# EAGLE design OSSIBeacon (EAGLE 6.1)

## Sheet 1 of 3
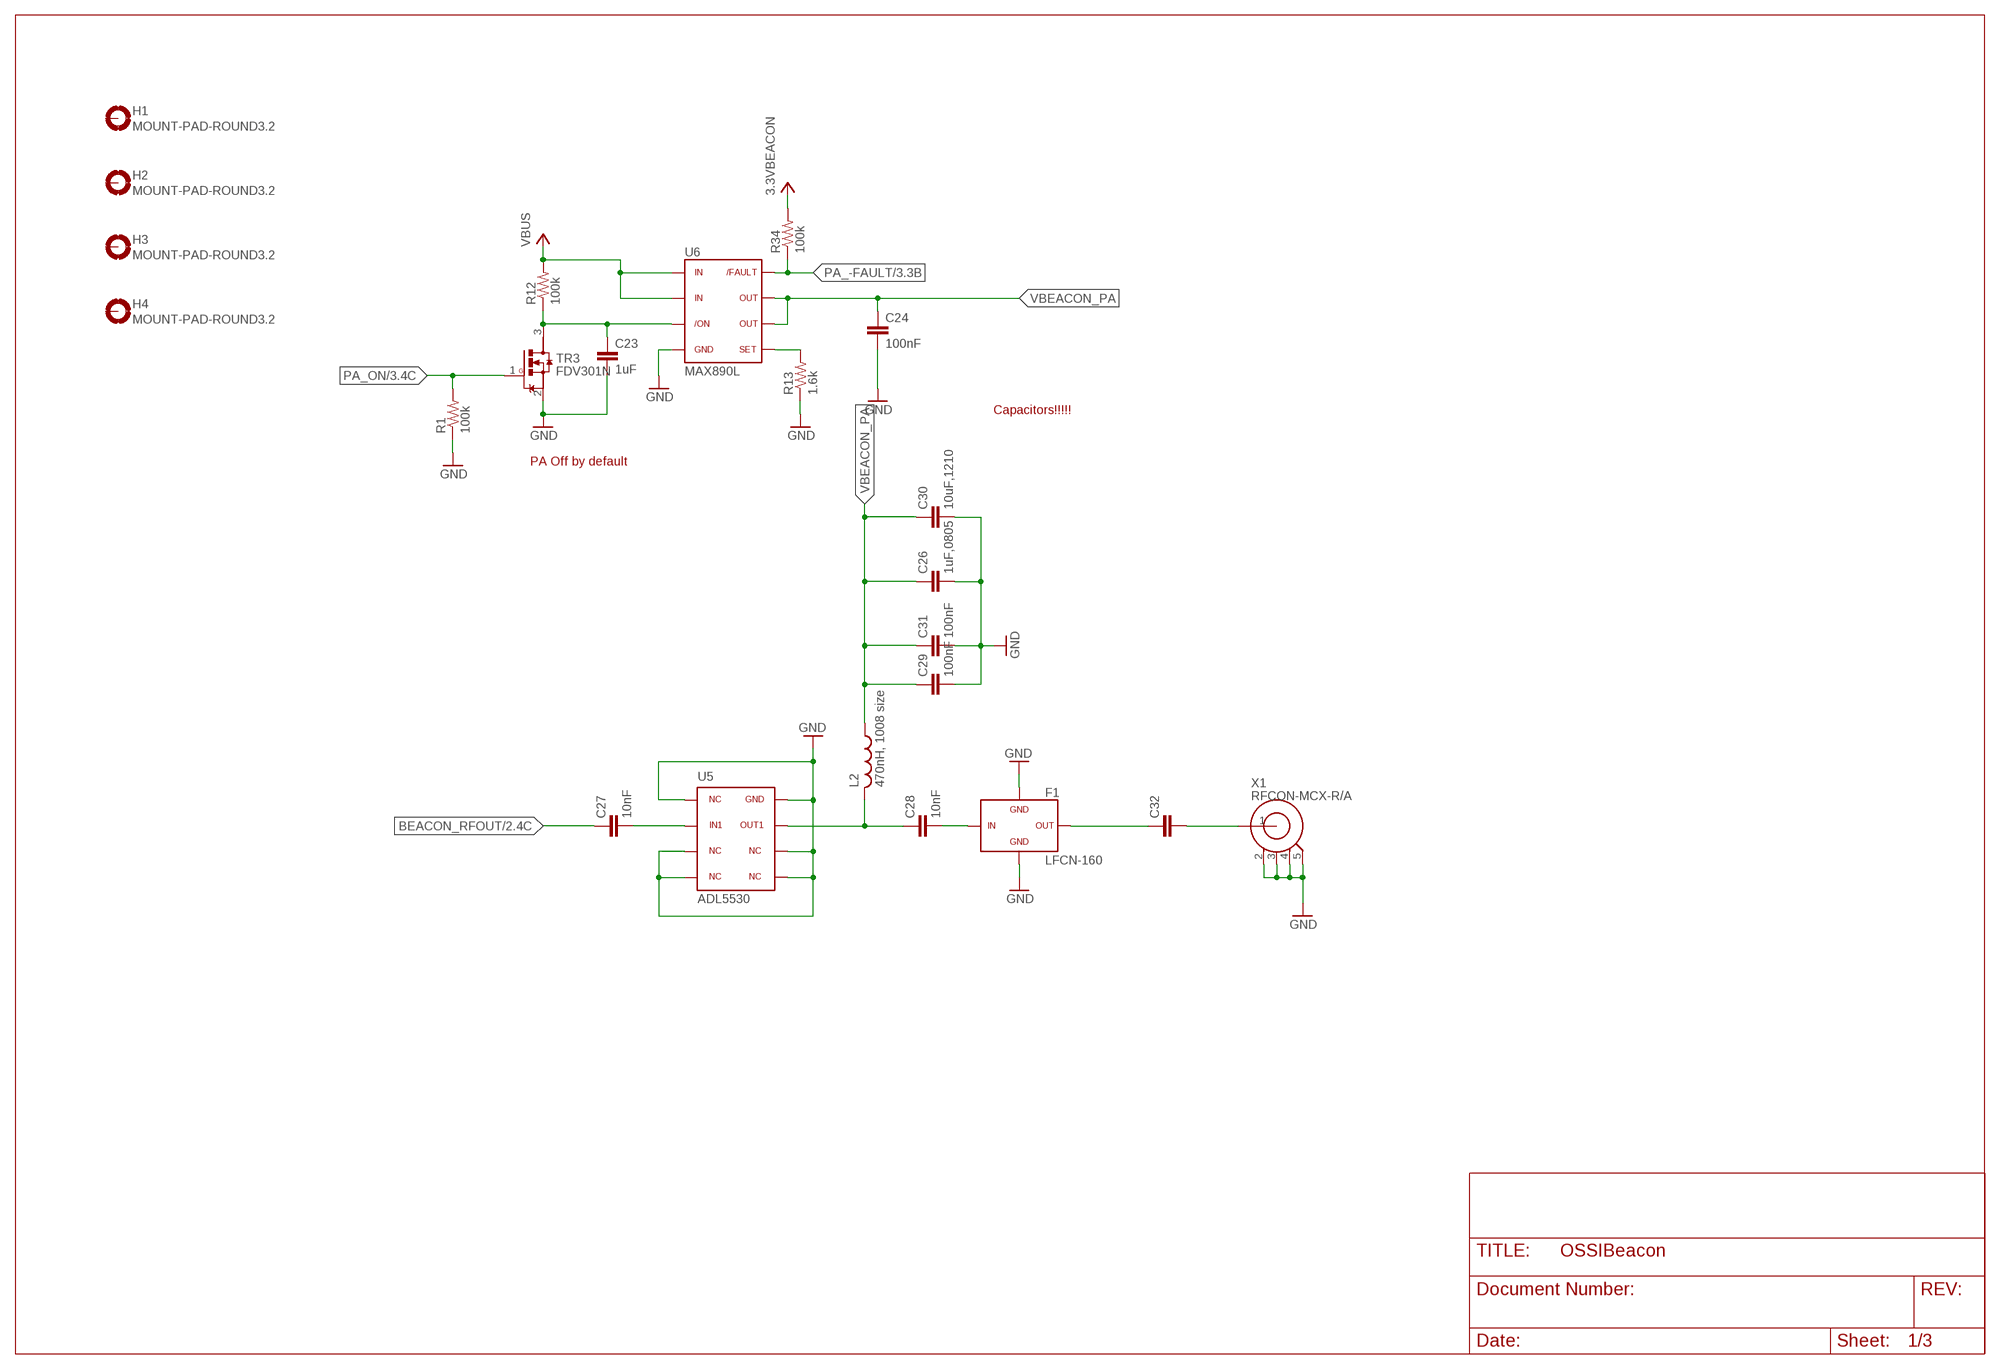
[diagram p0: schematic, sheet 1]

### Parts
C23  1uF  C0603(1608)  [C0603(1608)]
C24  100nF  C0603(1608)  [C0603(1608)]
C26  1uF,0805  C0805(2012)  [C0805(2012)]
C27  10nF  C0603(1608)  [C0603(1608)]
C28  10nF  C0603(1608)  [C0603(1608)]
C29  100nF  C0603(1608)  [C0603(1608)]
C30  10uF,1210  C1210(3225)-GCM32  [C1210-GCM32]
C31  100nF  C0603(1608)  [C0603(1608)]
C32  C0603(1608)  [C0603(1608)]
F1  LFCN-160  [LFCN]
H1  MOUNT-PAD-ROUND3.2  [3.2-PAD-ROUND]
H2  MOUNT-PAD-ROUND3.2  [3.2-PAD-ROUND]
H3  MOUNT-PAD-ROUND3.2  [3.2-PAD-ROUND]
H4  MOUNT-PAD-ROUND3.2  [3.2-PAD-ROUND]
L2  470nH, 1008 size  L1008(2502)  [L1008(2520)]
R1  100k  R0603(1608)  [R0603(1608)]
R12  100k  R0603(1608)  [R0603(1608)]
R13  1.6k  R0603(1608)  [R0603(1608)]
R34  100k  R0603(1608)  [R0603(1608)]
TR3  FDV301N  [SOT23]
U5  ADL5530  [LFCSP8_CP]
U6  MAX890L  [SO8]
X1  RFCON-MCX-R/A  [MCX-R/A]

### Nets
3.3VBEACON: R34.2 ; also sheet 3
BEACON_RFOUT: C27.1 ; also sheet 2
GND: C23.2 C24.2 C26.2 C29.2 C30.P$2 C31.2 F1.2 F1.4 R1.1 R13.1 TR3.2(S) U5.1 U5.3 U5.4 U5.5 U5.6 U5.8 U6.4 X1.2 X1.3 X1.4 X1.5 ; also sheet 2,3
N$19: C23.1 R12.1 TR3.3(D) U6.3
N$21: R13.2 U6.5
N$28: C27.2 U5.2
N$30: C28.1 L2.P$2 U5.7
N$34: C28.2 F1.1
N$35: C32.1 F1.3
N$37: C32.2 X1.1
PA_-FAULT: R34.1 U6.8 ; also sheet 3
PA_ON: R1.2 TR3.1(G) ; also sheet 3
VBEACON_PA: C24.1 C26.1 C29.1 C30.P$1 C31.1 L2.P$1 U6.6 U6.7
VBUS: R12.2 U6.1 U6.2 ; also sheet 3
Unconnected: H1.B3,2(MOUNT) H2.B3,2(MOUNT) H3.B3,2(MOUNT) H4.B3,2(MOUNT)

### Notes on the sheet
- Capacitors!!!!!
- PA Off by default

## Sheet 2 of 3
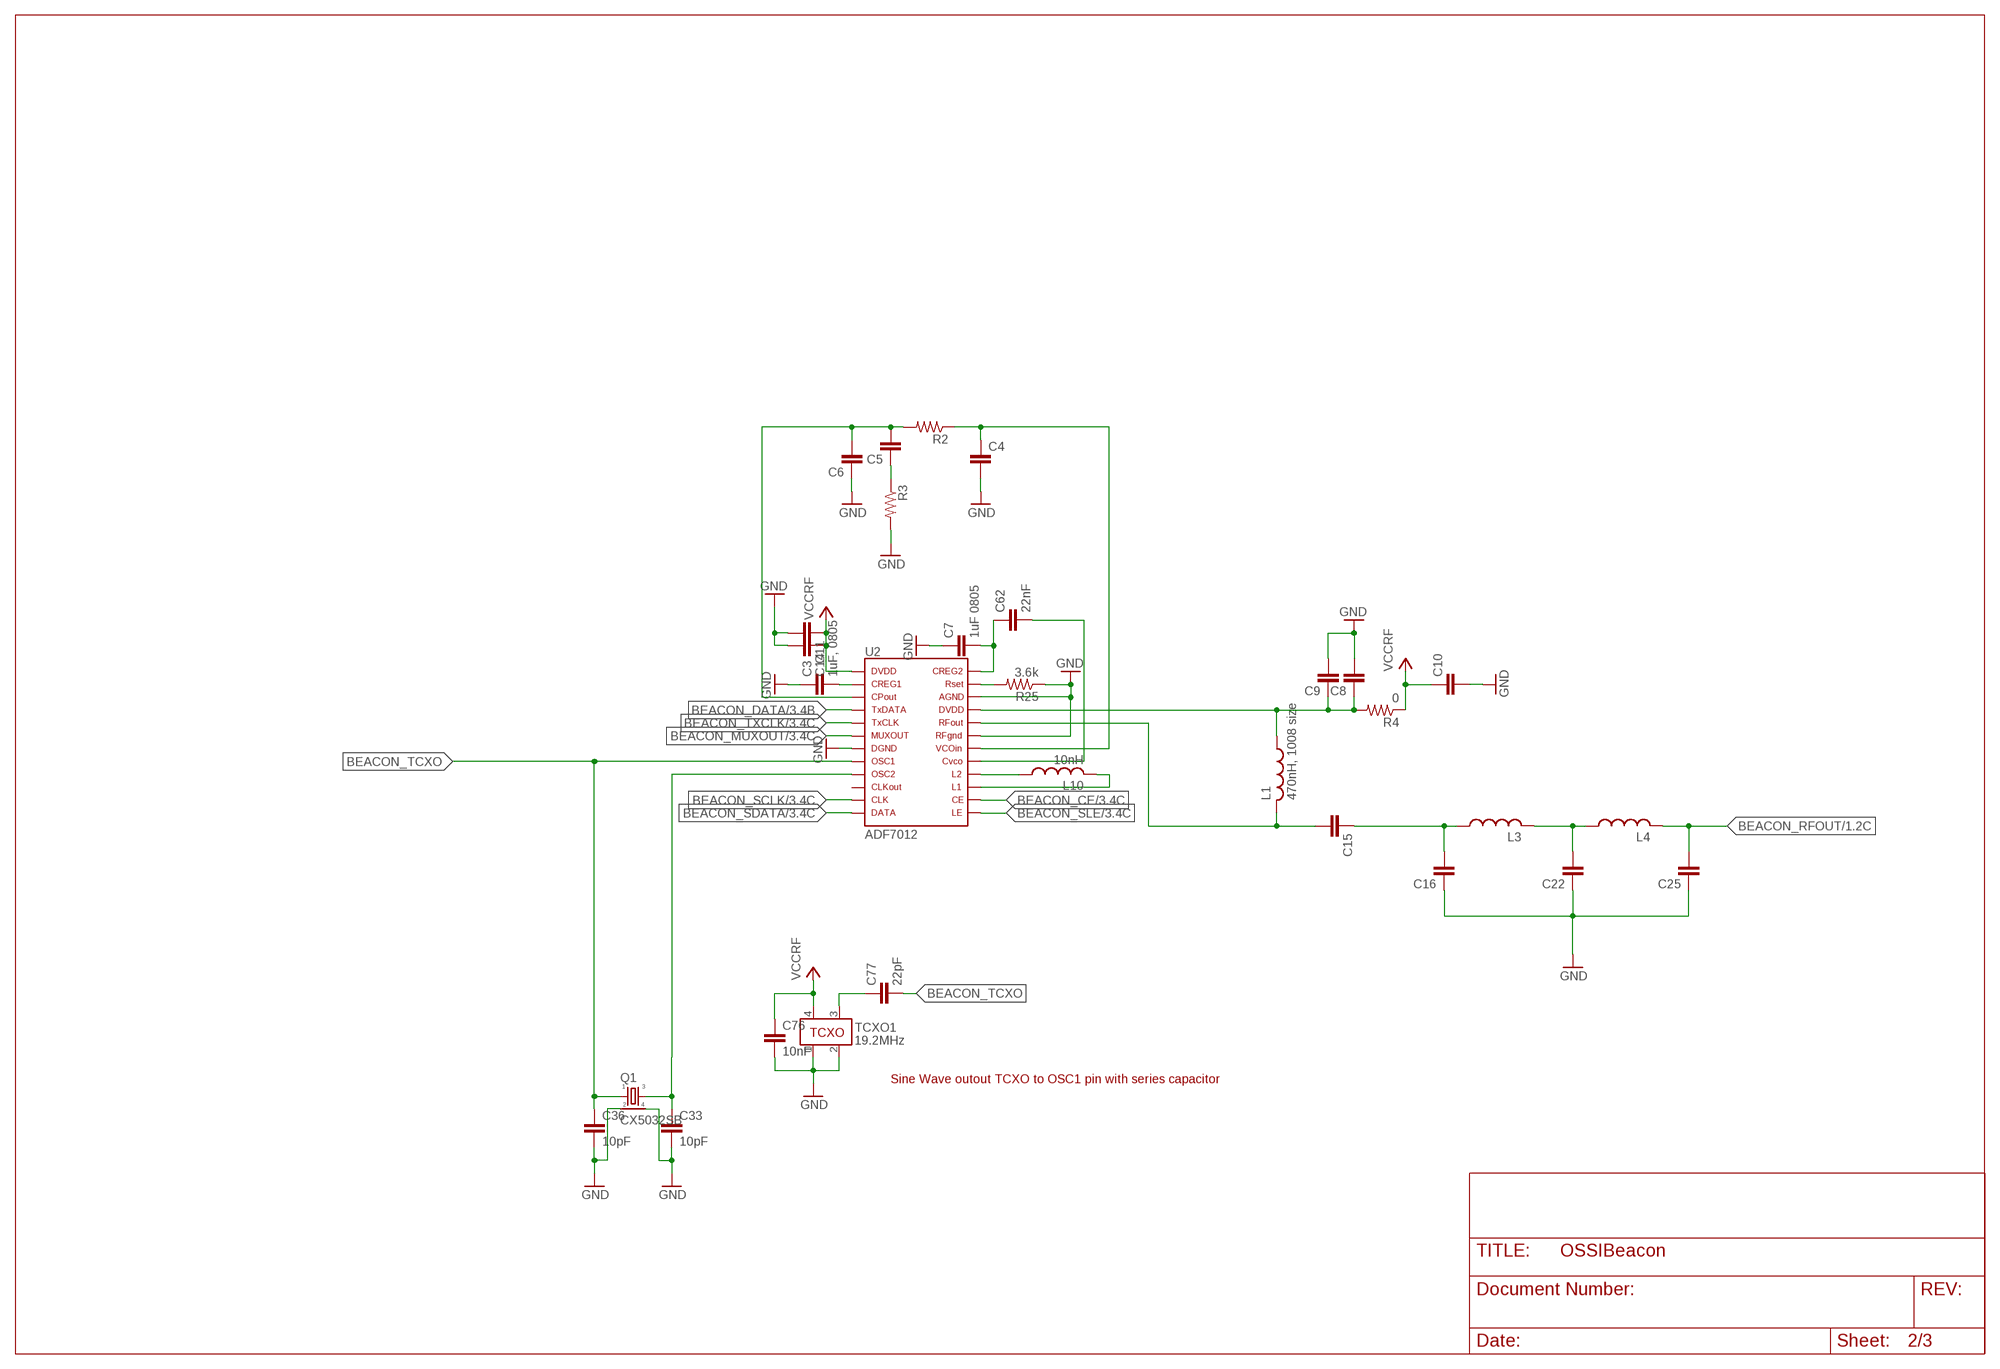
[diagram p1: schematic, sheet 2]

### Parts
C3  1uF, 0805  C0805(2012)  [C0805(2012)]
C4  C0603(1608)  [C0603(1608)]
C5  C0603(1608)  [C0603(1608)]
C6  C0603(1608)  [C0603(1608)]
C7  1uF 0805  C0805(2012)  [C0805(2012)]
C8  C0603(1608)  [C0603(1608)]
C9  C0603(1608)  [C0603(1608)]
C10  C0603(1608)  [C0603(1608)]
C11  C0603(1608)  [C0603(1608)]
C14  C0603(1608)  [C0603(1608)]
C15  C0603(1608)  [C0603(1608)]
C16  C0603(1608)  [C0603(1608)]
C22  C0603(1608)  [C0603(1608)]
C25  C0603(1608)  [C0603(1608)]
C33  10pF  C0603(1608)  [C0603(1608)]
C36  10pF  C0603(1608)  [C0603(1608)]
C62  22nF  C0603(1608)  [C0603(1608)]
C76  10nF  C0603(1608)  [C0603(1608)]
C77  22pF  C0603(1608)  [C0603(1608)]
L1  470nH, 1008 size  L1008(2502)  [L1008(2520)]
L3  L0603(1608)  [L0603(1608)]
L4  L0603(1608)  [L0603(1608)]
L10  10nH  L0603(1608)  [L0603(1608)]
Q1  CX5032SB  [CX5032]
R2  R0603(1608)  [R0603(1608)]
R3  R0603(1608)  [R0603(1608)]
R4  0  R0603(1608)  [R0603(1608)]
R25  3.6k  R0603(1608)  [R0603(1608)]
TCXO1  19.2MHz  TCXO-M532  [TCXO_M532]
U2  ADF7012  [TSSOP24]

### Nets
BEACON_CE: U2.14(CE) ; also sheet 3
BEACON_DATA: U2.4(TXDATA) ; also sheet 3
BEACON_MUXOUT: U2.6(MUXOUT) ; also sheet 3
BEACON_RFOUT: C25.2 L4.2 ; also sheet 1
BEACON_SCLK: U2.11(CLK) ; also sheet 3
BEACON_SDATA: U2.12(DATA) ; also sheet 3
BEACON_SLE: U2.13(LE) ; also sheet 3
BEACON_TCXO: C36.1 C77.2 Q1.1 U2.8(OSC1)
BEACON_TXCLK: U2.5(TXCLK) ; also sheet 3
GND: C3.1 C4.2 C6.1 C7.1 C8.2 C9.2 C10.2 C11.2 C14.2 C16.1 C22.1 C25.1 C33.2 C36.2 C76.2 Q1.2 Q1.4 R3.2 R25.1 TCXO1.1 TCXO1.2 U2.7(DGND) U2.19(RFGND) U2.22(AGND) ; also sheet 1,3
N$14: L10.1 U2.16(L2)
N$15: L10.2 U2.15(L1)
N$16: C7.2 C62.1 U2.24(CREG2)
N$17: C62.2 U2.17(CVCO)
N$18: R25.2 U2.23(RSET)
N$20: C5.1 R3.1
N$23: C15.2 L1.P$2 U2.20(RFOUT)
N$24: C4.1 R2.1 U2.18(VCOIN)
N$25: C3.2 U2.2(CREG1)
N$26: C5.2 C6.2 R2.2 U2.3(CPOUT)
N$27: C8.1 C9.1 L1.P$1 R4.2 U2.21(DVDD_2)
N$29: C15.1 C16.2 L3.1
N$36: C22.2 L3.2 L4.1
N$41: C33.1 Q1.3 U2.9(OSC2)
N$69: C77.1 TCXO1.3
VCCRF: C10.1 C11.1 C14.1 C76.1 R4.1 TCXO1.4 U2.1(DVDD_1) ; also sheet 3
Unconnected: U2.10(CLKOUT)

### Notes on the sheet
- Sine Wave outout TCXO to OSC1 pin with series capacitor

## Sheet 3 of 3
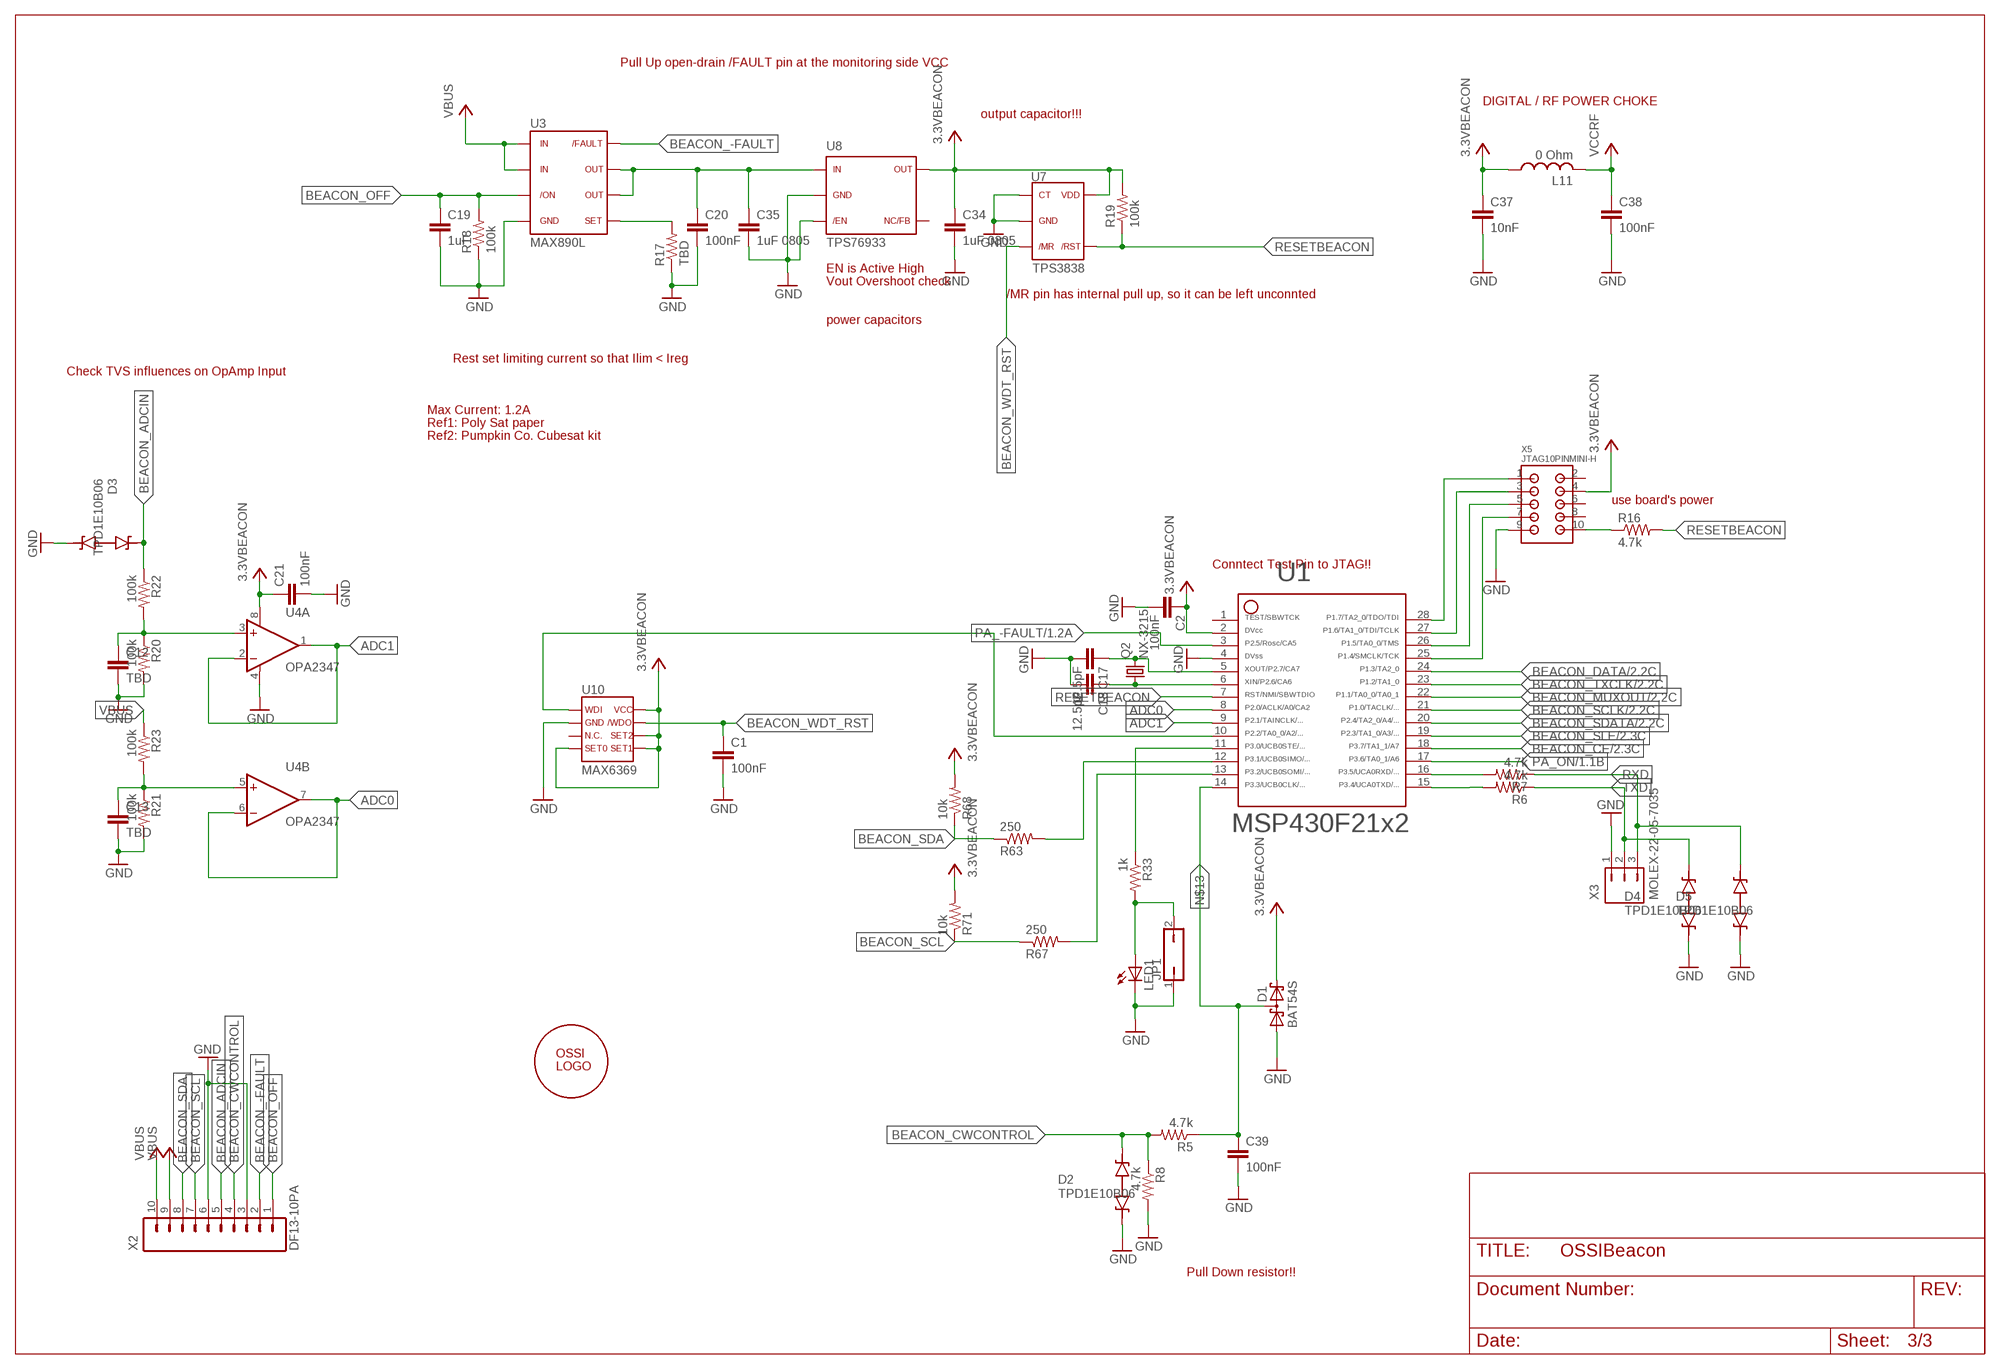
[diagram p2: schematic, sheet 3]

### Parts
C1  100nF  C0603(1608)  [C0603(1608)]
C2  100nF  C0603(1608)  [C0603(1608)]
C12  TBD  C0603(1608)  [C0603(1608)]
C13  TBD  C0603(1608)  [C0603(1608)]
C17  12.5pF  C0603(1608)  [C0603(1608)]
C18  12.5pF  C0603(1608)  [C0603(1608)]
C19  1uF  C0603(1608)  [C0603(1608)]
C20  100nF  C0603(1608)  [C0603(1608)]
C21  100nF  C0603(1608)  [C0603(1608)]
C34  1uF 0805  C0805(2012)  [C0805(2012)]
C35  1uF 0805  C0805(2012)  [C0805(2012)]
C37  10nF  C0603(1608)  [C0603(1608)]
C38  100nF  C0603(1608)  [C0603(1608)]
C39  100nF  C0603(1608)  [C0603(1608)]
D1  BAT54S  [SOT23]
D2  TPD1E10B06  [X2SON]
D3  TPD1E10B06  [X2SON]
D4  TPD1E10B06  [X2SON]
D5  TPD1E10B06  [X2SON]
JP1  JP1Q  [JP1]
L11  0 Ohm  L0805(2012)  [L0805(2012)]
LED1  LED0603  [LED-0603]
Q2  NX-3215  [NX-3215]
R5  4.7k  R0603(1608)  [R0603(1608)]
R6  4.7k  R0603(1608)  [R0603(1608)]
R7  4.7k  R0603(1608)  [R0603(1608)]
R8  4.7k  R0603(1608)  [R0603(1608)]
R16  4.7k  R0603(1608)  [R0603(1608)]
R17  TBD  R0603(1608)  [R0603(1608)]
R18  100k  R0603(1608)  [R0603(1608)]
R19  100k  R0603(1608)  [R0603(1608)]
R20  100k  R0603(1608)  [R0603(1608)]
R21  100k  R0603(1608)  [R0603(1608)]
R22  100k  R0603(1608)  [R0603(1608)]
R23  100k  R0603(1608)  [R0603(1608)]
R33  1k  R0603(1608)  [R0603(1608)]
R63  250  R0603(1608)  [R0603(1608)]
R67  250  R0603(1608)  [R0603(1608)]
R68  10k  R0603(1608)  [R0603(1608)]
R71  10k  R0603(1608)  [R0603(1608)]
U1  MSP430F2132  [PW28]
U3  MAX890L  [SO8]
U4  OPA2347  [SOT23-8DCN]
U7  TPS3838  [SOT23-5DBV]
U8  TPS76933  [SOT23-5DBV]
U10  MAX6369  [SOT23-8]
U$1  OSSILOGORECT  [OSSILOGORECT1005]
X2  DF13-10PA  [DF13A-10P]
X3  MOLEX-22-05-7035  [22-05-7035]
X5  JTAG10PINMINI-H  [M50-3200545]

### Nets
3.3VBEACON: C2.1 C21.1 C34.1 C37.1 D1.2(C2) L11.1 R19.2 R68.2 R71.2 U1.2 U4.8(A:V+) U7.5 U8.5 U10.4 U10.5 U10.6 U10.8 X5.4 ; also sheet 1
ADC0: U1.8 U4.6(B:-IN) U4.7(B:OUT)
ADC1: U1.9 U4.1(A:OUT) U4.2(A:-IN)
BEACON_-FAULT: U3.8 X2.2
BEACON_ADCIN: D3.1 R22.1 X2.5
BEACON_CE: U1.18 ; also sheet 2
BEACON_CWCONTROL: D2.1 R5.2 R8.1 X2.4
BEACON_DATA: U1.24 ; also sheet 2
BEACON_MUXOUT: U1.22 ; also sheet 2
BEACON_OFF: C19.1 R18.2 U3.3 X2.1
BEACON_SCL: R67.1 R71.1 X2.7
BEACON_SCLK: U1.21 ; also sheet 2
BEACON_SDA: R63.1 R68.1 X2.8
BEACON_SDATA: U1.20 ; also sheet 2
BEACON_SLE: U1.19 ; also sheet 2
BEACON_TXCLK: U1.23 ; also sheet 2
BEACON_WDT_RST: C1.1 U7.3 U10.7
GND: C1.2 C2.2 C12.2 C13.2 C17.2 C18.2 C19.2 C20.2 C21.2 C34.2 C35.2 C37.2 C38.2 C39.2 D1.1(A1) D2.2 D3.2 D4.2 D5.2 JP1.1 LED1.C R8.2 R17.1 R18.1 R20.2 R21.2 U1.4 U3.4 U4.4(A:V-) U7.1 U7.2 U8.2 U8.3 U10.2 X2.3 X2.6 X3.1 X5.9 ; also sheet 1,2
N$1: R33.1 U1.11
N$2: U1.27 X5.3
N$3: U1.26 X5.5
N$4: U1.25 X5.7
N$5: C17.1 Q2.2 U1.5
N$6: C18.1 Q2.1 U1.6
N$7: JP1.2 LED1.A R33.2
N$8: U1.28 X5.1
N$9: R63.2 U1.12
N$10: R67.2 U1.13
N$11: R7.2 U1.16
N$12: U1.10 U10.1
N$13: C39.1 D1.3(C1A2) R5.1 U1.14
N$22: C13.1 R21.1 R23.2 U4.5(B:+IN)
N$31: R16.1 X5.10
N$32: R17.2 U3.5
N$33: C12.1 R20.1 R22.2 U4.3(A:+IN)
N$39: R6.2 U1.15
N$666: C20.1 C35.1 U3.6 U3.7 U8.1
PA_-FAULT: U1.3 ; also sheet 1
PA_ON: U1.17 ; also sheet 1
RESETBEACON: R16.2 R19.1 U1.7 U7.4
RXD: D5.1 R7.1 X3.3
TXD: D4.1 R6.1 X3.2
VBUS: R23.1 U3.1 U3.2 X2.9 X2.10 ; also sheet 1
VCCRF: C38.1 L11.2 ; also sheet 2
Unconnected: U1.1 U8.4 U10.3 X5.2 X5.6 X5.8

### Notes on the sheet
- Pull Up open-drain /FAULT pin at the monitoring side VCC
- DIGITAL / RF POWER CHOKE
- output capacitor!!!
- EN is Active High
- Vout Overshoot check
- /MR pin has internal pull up, so it can be left unconnted
- power capacitors
- Rest set limiting current so that Ilim < Ireg
- Check TVS influences on OpAmp Input
- Max Current: 1.2A
- Ref1: Poly Sat paper
- Ref2: Pumpkin Co. Cubesat kit
- use board's power
- Conntect Test Pin to JTAG!!
- Pull Down resistor!!

## Library data of the parts
C1-C39 C62 C76 C77 = OSSI:C
D1 = OSSI:BAT54S: Schottky Diodes Pin connection corrected 2011-05-04 Source: Fairchild .. BAT54.pdf
D2-D5 = OSSI:TPD1E10B06: TPD1E10B06 TVS diode from TI.com
F1 = OSSI:LFCN-160: LFCN-160 Low Pass Filter DC - 160MHz Low Pass Filter Cut Off Freq: 230MHz 8W power rating ( degraded to 3W at 100 celcius degree)
H1-H4 = OSSI:MOUNT-PAD-ROUND
JP1 = OSSI:JP1Q: JUMPER
L1-L4 L10 L11 = OSSI:L
LED1 = SparkFun:LED: LEDs Standard schematic elements and footprints for 5mm, 3mm, 1206, and 0603 sized LEDs. 5mm - Spark Fun Electronics SKU : COM-00529 (and others)
Q1 = OSSI:CX5032SB: AVX 19.2MHz Crystal CX5032SB19200F0FLJZZ Ground pin 2 and 4 CRYSTAL, SM, CX-96F, 19.200MHZ Frequency:19.2MHz Frequency Tolerance:± 10ppm Load Capacitance:10pF Frequency Stability: ± 10ppm Operating Temperature Range: -30°C to +85°C Crystal Mounting Type: SMD Crystal Case Type: 5mm x 3.2mm No. of Pins: 4 SVHC: No SVHC (18-Jun-2012) Accuracy: ± 10ppm Frequency Accuracy + @: 10ppm Frequency Accuracy - @: 10ppm Operating Temperature Max: 85°C Operating Temperature Min: -30°C Output Frequency: 19.200MHz Series: CX5032SB Temperature Stability + @: 15 ppm Temperature Stability - @: 15 ppm Temperature Stabilty: ± 10ppm
Q2 = OSSI:NX-3215: NDK 32.768 kHz SMD Crystal P/N: NX3215SA-32.768K-STD-MUA-9 Nominal frequency (kHz): 32.768 Package Size (L×W×H : mm): 3.2×1.5×0.8 Operating Temperature Range(*1) / Storage Temperature Range (°C): -40 to +85 / -40 to +85 Level of drive: 0.1µW (Max. 0.5µW) Frequency Tolerance (25±3°C): ±20×10-6 Load Capacitance: 9.0pF, 12.5pF Equivalent Series Resistance: 70kΩ Max. Ordering Code: NX3215SA-32.768K-STD-MUA-9 (Load Capacitance9.0pF) /NX3215SA-32.768K-STD-MUA-8 (Load Capacitance12.5pF)
R1-R8 R12 R13 R16-R23 R25 R33 R34 R63 R67 R68 R71 = OSSI:R
TCXO1 = OSSI:TCXO-M532: 532L25DT19M2000: CTO electronic components Model 532 19.2MHz TCXO for RF transeiver Clipped Sine Wave Output Operating Voltage, +3.3Vdc Operating Temperature to -30°C to +85°C Frequency Stability: ±2.5ppm
TR3 = OSSI:FDV301N: FDV301N Digital N channel - FET / Rdson = 5 Ohm / Vgs = 0.7~1.06V / Ids = 220mA
U1 = OSSI:MSP430F2132: *** MSP430F21x2 *** PW28
U2 = OSSI:ADF7012
U3 U6 = OSSI:MAX890L: MAX 890L 1.2A, Current-Limited, High-Side P-Channel Switch with Thermal Shutdown BY MAXIM
U4 = OSSI:OPA2347: OPA2347 RAIL-TO-RAIL INPUT AND OUTPUT SINGLE SUPPLY: 2.3V to 5.5V LOW IQ: 20µ
U5 = OSSI:ADL5530: ADL5530 IF Gain Block Fixed gain: 16.dB Operation: 0~1000Mhz Internally matched input and output to 50 Ω Power supply: 3V or 5V 110 mA power supply current
U7 = OSSI:TPS3838: TPS3838 NanoPower Supervisory IC from texas instruments. TPS3838 is open-drain output
U8 = OSSI:TPS769*: TPS769XX series LDO 100mA / 70mV drop out
U10 = OSSI:MAX6369: MAX6369 Pin-Selectable Watchdog Timers Max 6369 is Open-drain output 1 ms to 60 s seletable timeout
U$1 = OSSI:OSSILOGO
X1 = OSSI:RFCON: RF Connectors
X2 = OSSI:DF13-10P
X3 = OSSI:MOLEX-22-05-7035
X5 = OSSI:JTAG10PINMINI

## Board
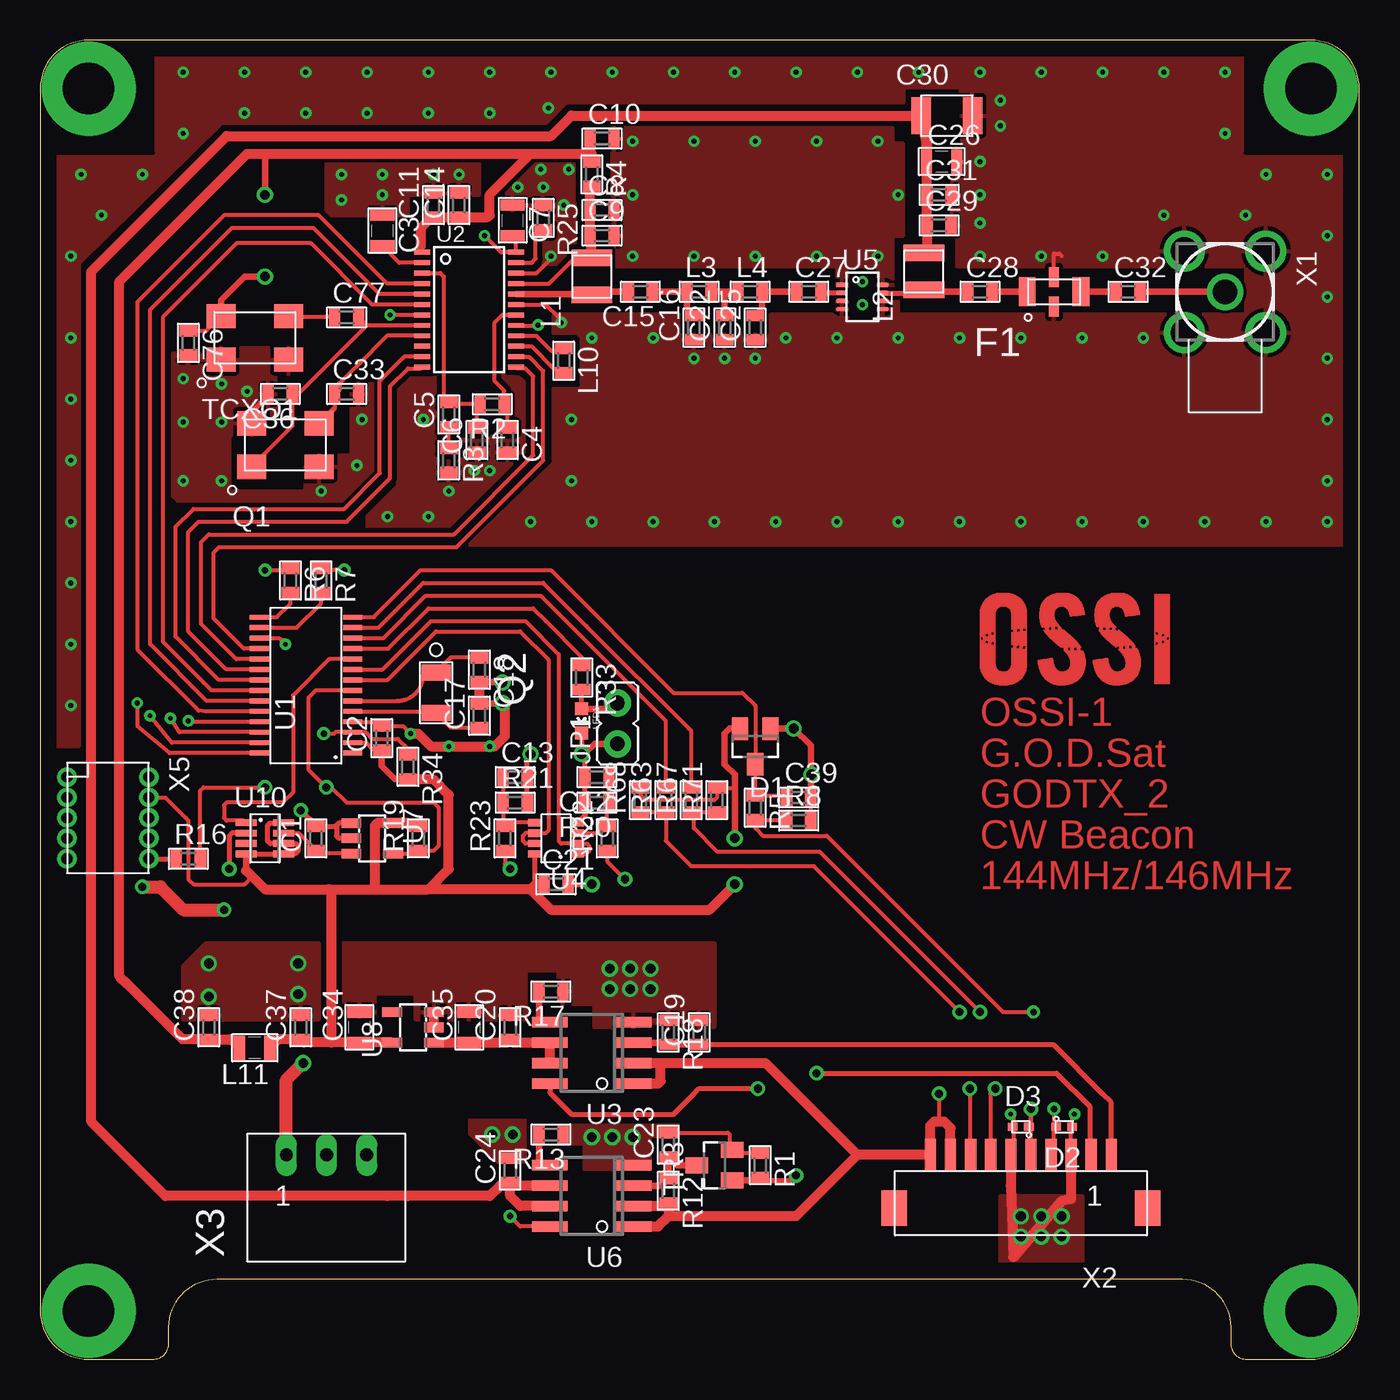
[diagram p3: board, top side]
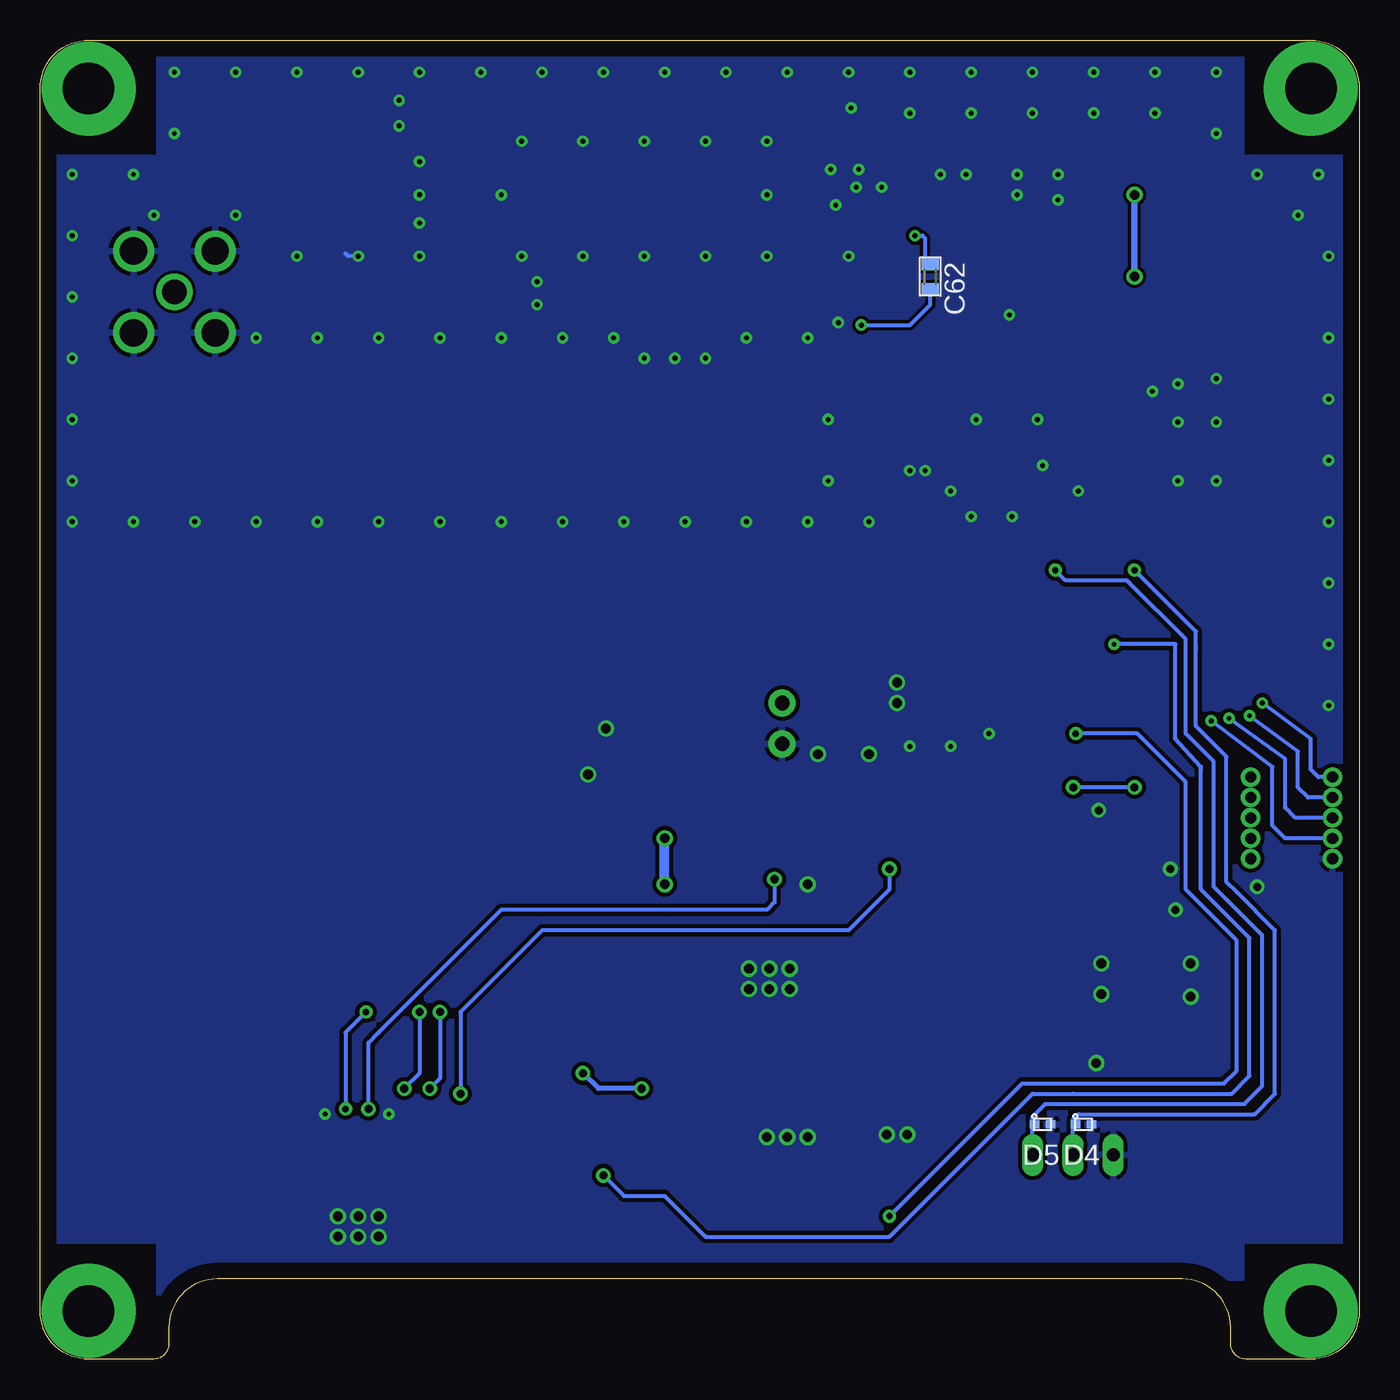
[diagram p4: board, bottom side, seen from below]

Size 82 x 82 mm. Coordinates in mm from the lower left corner, seen from the top.
Outline: 79,82 3,82 arc90 0,79 0,3 arc90 3,0 7,0 arc90 8,1 8,2 arc-90 11,5 71,5 arc-90 74,2 74,1 arc90 75,0 79,0 arc90 82,3 82,79 arc90 79,82
Copper layers (1*16): Top 0.035mm / dielectric 1.5mm / Bottom 0.035mm
Design rules: minimum track width 10mil, minimum drill 24mil, track to track 8mil, track to pad 8mil, pad to pad 8mil, via to via 8mil, smd to smd 8mil, copper to edge 40mil, drill to drill 8mil, minimum pad ring 10mil, minimum via ring 8mil, stop-mask expansion 4mil, vias tented up to drill 0mil, thermal gap 10mil

### Footprints (pad centres in the part's own frame; a part is rotated, then mirrored left to right if it is on the bottom)
C0603(1608) = smd 0.7 x 1.1: 1 -0.75,0; 2 0.75,0
C0805(2012) = smd 0.7 x 1.5: 1 -0.95,0; 2 0.95,0
C1210-GCM32 = smd 1.2 x 2.3: P$1 -1.6,0; P$2 1.6,0
SOT23 = smd 1 x 1.4: 1 -0.95,-1.1; 2 0.95,-1.1; 3 0,1.1
X2SON = smd 0.6 x 0.5: 1 -0.5,0; 2 0.5,0
LFCN = smd 1.045 x 1.8: 1 -1.675,0; 3 1.675,0 | smd 0.61 x 1.25: 2 0,-0.925; 4 0,0.925
3.2-PAD-ROUND = drill 3.2 pad 5.842: B3,2 0,0
JP1 = drill 0.914 pad 1.676: 1 0,-1.27; 2 0,1.27
L1008(2520) = smd 2.54 x 1.02: P$1 0,1.145; P$2 0,-1.145
L0603(1608) = smd 0.7 x 1.1: 1 -0.75,0; 2 0.75,0
L0805(2012) = smd 0.7 x 1.5: 1 -0.95,0; 2 0.95,0
LED-0603 = smd 0.8 x 0.8: A 0,-0.75; C 0,0.75
CX5032 = smd 1.8 x 1.5: 1 -2.1,-1.35; 2 2.1,-1.35; 3 2.1,1.35; 4 -2.1,1.35
NX-3215 = smd 1 x 1.8: 1 -1.25,0; 2 1.25,0
R0603(1608) = smd 0.7 x 1.1: 1 -0.75,0; 2 0.75,0
TCXO_M532 = smd 1.8 x 1.5: 1 -2.1,-1.35; 2 2.1,-1.35; 3 2.1,1.35; 4 -2.1,1.35
PW28 = smd 0.3 x 1.2: 1 -4.229,-2.908; 2 -3.579,-2.908; 3 -2.929,-2.908; 4 -2.279,-2.908; 5 -1.629,-2.908; 6 -0.979,-2.908; 7 -0.329,-2.908; 8 0.321,-2.908; 9 0.971,-2.908; 10 1.621,-2.908; 11 2.271,-2.908; 12 2.921,-2.908; 13 3.571,-2.908; 14 4.221,-2.908; 15 4.221,2.892; 16 3.571,2.892; 17 2.921,2.892; 18 2.271,2.892; 19 1.621,2.892; 20 0.971,2.892; 21 0.321,2.892; 22 -0.329,2.892; 23 -0.979,2.892; 24 -1.629,2.892; 25 -2.279,2.892; 26 -2.929,2.892; 27 -3.579,2.892; 28 -4.229,2.892
TSSOP24 = smd 0.305 x 0.991: 1 -3.575,-2.918; 2 -2.925,-2.918; 3 -2.275,-2.918; 4 -1.625,-2.918; 5 -0.975,-2.918; 6 -0.325,-2.918; 7 0.325,-2.918; 8 0.975,-2.918; 9 1.625,-2.918; 10 2.275,-2.918; 11 2.925,-2.918; 12 3.575,-2.918; 13 3.575,2.918; 14 2.925,2.918; 15 2.275,2.918; 16 1.625,2.918; 17 0.975,2.918; 18 0.325,2.918; 19 -0.325,2.918; 20 -0.975,2.918; 21 -1.625,2.918; 22 -2.275,2.918; 23 -2.925,2.918; 24 -3.575,2.918
SO8 = smd 0.65 x 2.2: 1 -1.905,-2.6; 2 -0.635,-2.6; 3 0.635,-2.6; 4 1.905,-2.6; 5 1.905,2.6; 6 0.635,2.6; 7 -0.635,2.6; 8 -1.905,2.6
SOT23-8DCN = smd 0.45 x 0.8: 1 -0.975,-1.35; 2 -0.325,-1.35; 3 0.325,-1.35; 4 0.975,-1.35; 5 0.975,1.35; 6 0.325,1.35; 7 -0.325,1.35; 8 -0.975,1.35
LFCSP8_CP = smd 0.73 x 0.3: 1 -1.27,0.75; 2 -1.27,0.25; 3 -1.27,-0.25; 4 -1.27,-0.75; 5 1.27,-0.75; 6 1.27,-0.25; 7 1.27,0.25; 8 1.27,0.75
SOT23-5DBV = smd 0.6 x 1.22: 1 -0.95,-1.3; 2 0,-1.3; 3 0.95,-1.3; 4 0.95,1.3; 5 -0.95,1.3
SOT23-8 = smd 0.42 x 1.3: 1 -0.975,-1.175; 2 -0.325,-1.175; 3 0.325,-1.175; 4 0.975,-1.175; 5 0.975,1.175; 6 0.325,1.175; 7 -0.325,1.175; 8 -0.975,1.175
MCX-R/A = drill 1.5: 1 0,0 | drill 1.7: 2 -2.54,2.54; 3 2.54,2.54; 4 2.54,-2.54; 5 -2.54,-2.54
DF13A-10P = smd 0.7 x 2: 1 -5.625,0; 2 -4.375,0; 3 -3.125,0; 4 -1.875,0; 5 -0.625,0; 6 0.625,0; 7 1.875,0; 8 3.125,0; 9 4.375,0; 10 5.625,0 | smd 1.6 x 2.2: P$1 -7.875,3.3; P$2 7.875,3.3
22-05-7035 = drill 0.8 long: 1 -2.48,0; 2 0.02,0; 3 2.52,0
M50-3200545 = drill 0.7 pad 1: 1 -2.54,-2.54; 2 -2.54,2.54; 3 -1.27,-2.54; 4 -1.27,2.54; 5 0,-2.54; 6 0,2.54; 7 1.27,-2.54; 8 1.27,2.54; 9 2.54,-2.54; 10 2.54,2.54

### Placement (x,y rotation side)
C1  17.14,32.38 90 top
C2  21.23,38.61 90 top
C3  21.27,70.17 270 top
C4  29.05,57.15 270 top
C5  25.4,58.74 90 top
C6  27.15,57.15 90 top
C7  29.37,70.8 270 top
C8  34.92,71.44 0 top
C9  34.92,69.85 0 top
C10  34.92,75.88 0 top
C11  24.45,71.75 90 top
C12  34.61,36.2 180 top
C13  29.53,36.2 0 top
C14  26.04,71.75 90 top
C15  37.31,66.36 180 top
C16  40.64,64.14 90 top
C17  27.3,40.01 90 top
C18  27.3,42.86 270 top
C19  40.96,20.32 90 top
C20  29.21,20.64 90 top
C21  32.07,29.53 0 top
C22  42.55,64.14 90 top
C23  39.05,13.34 90 top
C24  29.21,11.75 90 top
C25  44.45,64.14 90 top
C26  56.04,74.45 0 top
C27  47.78,66.36 0 top
C28  58.42,66.36 0 top
C29  55.88,70.48 0 top
C30  56.36,77.31 0 top
C31  55.88,72.39 0 top
C32  67.63,66.36 0 top
C33  19.05,60.01 0 top
C34  19.84,20.64 90 top
C35  26.67,20.64 90 top
C36  14.92,60.01 180 top
C37  16.19,20.64 90 top
C38  10.48,20.64 90 top
C39  47.15,34.92 0 top
C62  26.67,67.31 270 bottom
C76  9.21,63.18 270 top
C77  19.05,64.77 0 top
D1  44.45,38.1 180 top
D2  63.66,14.45 0 top
D3  60.96,14.45 180 top
D4  17.14,14.61 0 bottom
D5  19.68,14.61 0 bottom
F1  63.02,66.36 0 top
H1  3,3 0 top
H2  3,79 0 top
H3  79,79 0 top
H4  79,3 0 top
JP1  35.88,39.53 0 top
L1  34.29,67.31 0 top
L2  54.93,67.63 0 top
L3  40.96,66.36 0 top
L4  44.13,66.36 0 top
L10  32.54,62.07 270 top
L11  13.34,19.37 180 top
LED1  33.66,39.69 180 top
Q1  15.24,56.83 0 top
Q2  24.61,41.43 270 top
R1  44.77,12.06 270 top
R2  28.1,59.37 180 top
R3  25.4,55.88 270 top
R4  34.29,73.66 270 top
R5  44.45,34.29 270 top
R6  15.56,48.42 270 top
R7  17.46,48.42 270 top
R8  47.15,33.5 0 top
R12  39.05,10.48 270 top
R13  31.75,13.97 180 top
R16  9.21,31.11 0 top
R17  31.75,22.86 180 top
R18  39.05,20.32 270 top
R19  23.5,32.38 90 top
R20  34.61,34.61 180 top
R21  29.53,34.61 0 top
R22  35.24,32.38 90 top
R23  28.89,32.38 90 top
R25  31.27,70.96 270 top
R33  33.66,42.39 270 top
R34  22.86,36.83 270 top
R63  38.89,34.77 90 top
R67  40.48,34.77 90 top
R68  37.31,34.77 90 top
R71  42.07,34.77 90 top
TCXO1  13.34,63.5 0 top
TR3  41.91,12.06 90 top
U1  16.51,41.91 90 top
U2  26.67,65.25 270 top
U3  34.29,19.05 90 top
U4  32.07,32.38 90 top
U5  51.12,66.04 0 top
U6  34.29,10.16 90 top
U7  20.64,32.38 270 top
U8  23.18,20.64 90 top
U10  13.97,32.38 270 top
U$1  58.42,41.91 0 top
X1  73.66,66.36 270 top
X2  60.96,12.7 180 top
X3  17.78,12.7 0 top
X5  4.21,33.66 270 top

### Tracks (layer width: path | path; a pad name or v marks a point on that pad's centre or on a via)
3.3VBEACON  (via drill 0.6)
  Top 0.254: X5.4 7.78,34.92 9.05,33.66 9.21,33.5 9.21,29.84 9.53,29.53 12.7,29.53 13.18,30 | U1.2 20.25,38.33 20.64,37.94 21.15,37.94 C2.1 | R68.2 37.31,35.08 37.62,34.77 41.91,34.77 42.07,34.92 R71.2 43.14,35.52 43.18,35.56 | U4.8 30.72,29.45 30.48,29.21
  Top 0.305: U4.8 30.72,29.45 30.48,29.21 | U10.4 U10.5 15.17,31.43 15.88,31.43 16.03,31.59 16.03,31.91 15.88,32.06 U10.6 14.29,32.06 14.13,32.23 14.13,33.18 14.29,33.34 15.12,33.34 U10.8 | 12.64,30.32 12.79,30.48
  Top 0.406: U10.4 12.79,30.48 12.79,30.39 | C2.1 21.23,36.87 21.75,36.35 22.02,36.08 R34.2 | D1.2 42.85,39.2 42.55,38.89 42.55,36.99 43.18,36.35 43.18,35.56 v43.18,32.38
  Top 0.61: 18.1,19.69 C34.1 U8.5 | 18.1,19.69 16.39,19.69 C37.1 14.8,19.89 L11.1 | 12.79,30.39 13.18,30 13.97,29.21 | 13.97,29.21 20.8,29.21 | 20.8,29.21 24.13,29.21 | 24.13,29.21 25.4,30.48 25.4,35.08 24.45,36.04 22.9,36.04 R34.2 | 20.8,29.21 20.8,33.18 20.95,33.34 U7.5 22.86,33.34 23.06,33.13 R19.2 | C21.1 30.8,29.53 30.48,29.21 | 30.48,29.21 24.13,29.21 | 13.97,29.21 17.94,29.21 18.1,29.05 18.1,19.69 | 18.1,19.69 18.1,19.68 18.1,19.69 | 30.48,29.21 31.75,27.94 41.59,27.94 v43.18,29.53
  Bottom 0.61: v43.18,29.53 v43.18,32.38
ADC0
  Top 0.254: U4.7 30.17,32.06 30,32.23 30,32.54 30.17,32.71 U4.6 31.44,32.71 31.59,32.86 31.59,43.5 29.84,45.24 24.61,45.24 21.59,42.23 U1.8
ADC1
  Top 0.254: U4.1 33.95,31.41 34.13,31.59 34.13,31.91 33.98,32.06 U4.2 32.39,32.06 32.38,32.07 32.23,32.23 32.23,43.81 30.16,45.88 24.29,45.88 21.29,42.88 U1.9
BEACON_-FAULT  (via drill 0.5)
  Top 0.305: U3.8 31.69,16.57 33.02,15.24 39.37,15.24 40.64,16.51 40.96,16.83 43.18,16.83 v44.61,16.83 | v48.26,17.78 63.18,17.78 65.25,15.72 65.25,12.79 X2.2
  Bottom 0.305: v44.61,16.83 47.31,16.83 v48.26,17.78
BEACON_ADCIN  (via drill 0.5)
  Top 0.254: R22.1 35.24,30.96 v36.35,29.84 | X2.5 61.59,15.23 | 61.59,15.23 v61.59,15.56 | 61.59,15.23 61.59,14.57 D3.1
  Bottom 0.254: v36.35,29.84 36.35,28.42 36.83,27.94 53.34,27.94 60.96,20.32 61.59,19.68 v61.59,15.56
BEACON_CE
  Top 0.254: U1.18 12.65,44.18 10.79,46.04 10.79,50.16 11.11,50.48 25.88,50.48 31.27,55.88 31.27,61.44 30.48,62.23 30.39,62.32 U2.14
BEACON_CWCONTROL  (via drill 0.4)
  Top 0.254: R5.2 44.45,33.5 | 44.45,33.5 44.45,33.02 | 44.45,33.02 44.93,32.54 48.9,32.54 59.85,21.59 v61.75,21.59 | v63.02,15.56 63.02,14.63 D2.1 | X2.4 63,12.87 63,14.58 63.02,14.61 D2.1 | D2.1 63.18,14.61 D2.1 | R8.1 44.45,33.5 | 44.45,33.5 44.45,33.02
  Bottom 0.254: v61.75,21.59 63.02,20.32 v63.02,15.56
BEACON_DATA
  Top 0.254: U2.4 21.55,66.87 17.3,71.12 11.43,71.12 6.03,65.72 6.03,44.13 9.84,40.32 10.28,40.28 U1.24
BEACON_MUXOUT
  Top 0.254: U2.6 20.63,65.57 16.83,69.37 12.22,69.37 7.62,64.77 7.62,44.61 10.16,42.07 10.65,41.58 U1.22
BEACON_OFF
  Top 0.305: C19.1 62.98,19.57 66.04,16.51 66.58,15.96 X2.1
  Top 0.406: U3.3 38.94,19.68 R18.2 C19.1
BEACON_RFOUT
  Top 0.406: C25.2 44.88,65.32 L4.2 C27.1
BEACON_SCL  (via drill 0.5)
  Top 0.254: v58.42,21.59 48.46,31.55 42.11,31.55 40.64,33.02 40.64,33.86 R67.1 R71.1 | v59.37,16.83 59.05,16.51 59.05,12.73 X2.7
  Bottom 0.254: v58.42,21.59 58.42,17.78 v59.37,16.83
BEACON_SCLK
  Top 0.254: U1.21 11.11,42.23 8.41,44.93 8.41,51.75 9.53,52.86 18.89,52.86 21.11,55.09 21.11,60.8 22.54,62.23 22.63,62.32 U2.11
BEACON_SDA  (via drill 0.5)
  Top 0.254: v57.15,21.59 49.69,29.05 48.1,30.64 40.48,30.64 39.37,31.75 38.89,32.23 R63.1 R68.1 | v57.78,16.83 57.78,12.75 X2.8
  Bottom 0.254: v57.15,21.59 57.15,17.46 v57.78,16.83
BEACON_SDATA
  Top 0.254: U1.20 11.57,42.88 9.21,45.24 9.21,51.44 9.84,52.07 19.05,52.07 21.75,54.77 21.75,60.48 22.86,61.59 23.68,61.59 U2.12
BEACON_SLE
  Top 0.254: U1.19 12.19,43.53 10,45.72 10,50.8 10.48,51.28 25.72,51.28 30.64,56.2 30.64,61.12 30.16,61.59 29.66,61.59 U2.13
BEACON_TCXO
  Top 0.254: U2.8 20.3,64.27 16.04,60.01 | C36.1 15.67,58.02 Q1.1
  Top 0.305: 20.3,64.27 C77.2 | C36.1 16.04,60.01
BEACON_TXCLK
  Top 0.254: U2.5 21.09,66.22 16.99,70.33 11.91,70.33 6.91,65.33 | 6.91,65.33 6.83,65.25 | U1.23 10.35,40.93 6.83,44.45 6.83,65.25 | 6.83,65.25 6.91,65.33
BEACON_WDT_RST
  Top 0.254: U10.7 16.07,32.71 C1.1 17.34,31.43 U7.3
GND  (via drill 0.3, 0.5, 0.6)
  Top 0.254: U2.7 22.39,64.92 v21.74,64.92 v21.75,64.93 | U2.22 30.85,67.52 31.91,68.58 | U2.19 31.43,65.57 32.23,64.77 | R1.1 43.06,12.81 | 43.06,12.81 43.02,12.86 43.01,12.87 TR3.2 42.86,13.16 42.86,13.97 42.75,14.09 C23.2 | 43.06,12.81 43.18,12.7 | U1.4 20.96,39.63 C2.2 22.55,39.36 v23.02,38.89 | F1.4 63.02,68.74 63.34,68.74 63.5,68.58 | D2.2 64.16,14.95 64.29,15.08 v64.29,15.24 | X2.3 64.08,14.4 64.14,14.45 | R8.2 C39.2 | v60.33,15.24 60.48,15.08 60.48,14.61 | 60.48,14.61 60.48,12.86 | D3.2 60.46,14.58 60.48,14.61
  Top 0.305: Q1.4 13.14,58.86 14.17,59.89 C36.2 | C35.2 26.51,21.59 | C21.2 v34.29,29.53 | R21.2 30.28,35.99 30.48,36.2 C13.2 30.28,37.42 v30.48,37.62 | U4.4 33.86,33.8 R20.2 C12.2 33.86,37.42 v33.66,37.62 LED1.C | U7.2 18.57,32.38 18.41,32.54 18.41,33.02 | U7.1 18.58,33.34 18.57,33.34 18.41,33.18 18.41,33.02 | 18.41,33.02 18.3,33.13 C1.2 17.14,33.18 v16.19,34.13 | U10.2 11.91,32.71 11.75,32.54 v11.75,30.48
  Top 0.406: C18.2 28.69,42.11 v28.73,42.07 | C17.2 28.69,40.76 v28.73,40.8 | D1.1 v46.82,39.2 v46.83,39.21 47.9,38.14 C39.2 | JP1.1 34.45,38.26 33.81,37.62
  Top 0.61: X2.6 60.34,10.79 60.48,6.35 63.5,9.84 64.08,9.95 X2.3 | C17.2 27.3,42.07 | v23.02,38.89 23.5,38.89 24.29,38.1 28.26,38.1 28.89,38.73 28.89,40.64 v28.73,40.8 | U8.2 24.48,21.56 24.45,21.59 | U8.3 24.45,21.59 | 24.45,21.59
  Top 0.813: X3.1 15.3,17.36 v16.35,18.41 | v6.35,29.37 7.46,29.37 8.89,27.94 v11.43,27.94
  Bottom 0.254: v62.23,68.58 62.87,68.58 63.02,68.74
  other vias: 11.27,58.26 19.68,55.56 8.89,60.96 20,58.42 8.89,54.61 23.81,58.42 25.4,53.98 26.99,55.24 27.94,55.24 21.59,52.39 24.13,52.39 21.27,72.39 24.45,73.66 26.04,73.66 18.73,73.66 18.73,72.07 21.27,73.66 29.69,72.87 31.27,72.87 31.11,73.98 32.86,73.98 31.75,68.58 32.54,71.75 73.66,80.01 69.85,80.01 73.66,76.2 76.2,73.66 66.04,80.01 62.23,80.01 58.42,72.39 59.69,76.68 52.07,68.58 48.26,68.58 53.34,72.39 44.45,75.72 40.64,75.72 36.83,75.72 44.45,68.58 40.64,68.58 36.83,68.58 36.83,72.39 52.07,75.72 48.26,75.72 58.42,68.58 66.04,68.58 69.85,71.12 74.93,71.12 80.01,73.66 80.01,69.85 80.01,66.04 80.01,62.23 80.01,58.42 80.01,54.61 53.34,63.5 49.53,63.5 60.96,63.5 57.15,63.5 68.58,63.5 64.77,63.5 38.1,63.5 34.29,63.5 41.91,52.07 38.1,52.07 34.29,52.07 30.48,52.07 33.02,54.61 33.02,58.42 49.53,52.07 45.72,52.07 57.15,52.07 53.34,52.07 64.77,52.07 60.96,52.07 72.39,52.07 68.58,52.07 80.01,52.07 76.2,52.07 12.7,80.01 8.89,80.01 20.32,80.01 16.51,80.01 2.54,73.66 1.91,68.58 1.91,63.5 1.91,59.69 1.91,55.88 1.91,52.07 27.94,80.01 24.13,80.01 35.56,80.01 31.75,80.01 43.18,80.01 39.37,80.01 50.8,80.01 46.99,80.01 58.42,80.01 54.61,80.01 6.35,73.66 8.89,76.2 12.7,77.47 16.51,77.47 20.32,77.47 24.13,77.47 27.94,77.47 31.59,77.79 3.81,71.12 60.96,7.62 60.96,8.89 62.23,7.62 62.23,8.89 63.5,7.62 63.5,8.89 10.48,22.54 16.03,22.7 16.03,24.61 10.48,24.61 35.4,24.29 36.67,24.29 37.94,23.02 37.94,24.29 36.67,23.02 35.4,23.02 36.83,13.81 35.56,13.81 34.29,13.81 28.1,13.97 29.37,13.97 25.4,38.1 27.94,38.1 8.89,58.26 11.27,60.64 17.46,53.98 11.27,54.61 58.42,70.64 58.42,74.45 59.69,78.26 32.38,64.45 44.45,62.23 42.55,62.23 40.64,62.23 46.35,63.5 1.91,48.26 1.91,44.45 1.91,40.64 47.94,36.35 51.12,66.99 51.12,65.56 12.86,60.17
  pour Bottom: 0,82.55 82.55,82.55 82.55,50.8 0,50.8
  pour Top: 57.15,82.55 57.15,82.39 57.31,75.25 56.67,75.25 56.67,70.33 56.99,70.33 56.99,67.94 74.93,67.94 74.93,64.93 57.15,64.93 57.15,50.64 82.55,50.64 82.55,82.55
  pour Top: 58.42,64.93 53.34,64.93 53.34,65.72 52.07,65.72 52.07,64.45 50.16,64.45 50.16,65.72 49.53,65.72 49.53,64.93 45.4,64.93 45.4,63.66 39.69,63.66 39.69,64.93 34.29,64.93 34.29,50.64 58.42,50.64
  pour Top: 8.26,62.55 14.61,62.55 14.61,58.74 13.97,58.74 13.97,57.47 11.75,57.47 11.75,53.98 16.51,53.98 16.51,56.2 19.37,56.2 19.37,60.64 20.64,60.64 20.64,55.24 18.73,53.34 8.57,53.34 8.26,53.66
  pour Top: 16.19,61.59 16.19,62.87 13.97,62.87 10.48,62.87 10.48,60.33 12.06,60.33 13.02,61.28 16.19,61.28
  pour Top: 35.56,76.2 35.56,67.94 49.53,67.94 49.53,66.67 50.16,66.67 50.16,67.94 52.07,67.94 52.07,66.67 53.02,66.67 53.02,69.85 53.66,69.85 53.66,75.56 53.02,75.56 53.02,76.52 35.56,76.52
  pour Top (isolate 0.305): 22.86,60.96 22.23,60.33 22.23,54.29 20.32,52.39 20.32,51.75 25.4,51.75 30.16,56.52 30.16,60.64 29.53,61.28 28.57,61.28 28.26,61.59 28.26,65.72 28.26,68.58 25.08,68.58 25.08,61.59 24.45,60.96
  pour Top: 19.05,71.12 22.86,71.12 22.86,72.39 27.3,72.39 27.3,74.3 17.78,74.3 17.78,71.44 18.1,71.12
  pour Top: 28.89,71.44 33.18,71.44 33.18,74.3 30.8,74.3 28.89,72.39
  pour Top (isolate 0.305): 33.18,71.91 33.18,68.42 32.86,68.1 31.27,68.1 31.27,69.37 32.07,69.37 32.07,71.91
  pour Top: 34.29,64.93 31.91,64.93 31.91,63.82 33.34,63.82 33.66,63.5 33.66,60.48 33.5,60.33 31.91,60.33 31.91,55.72 26.67,50.64 34.29,50.64
  pour Top: 2.38,38.1 0,38.1 0,82.55 58.42,82.55 58.42,79.06 53.66,79.06 53.66,78.11 32.7,78.11 31.43,76.83 11.27,76.83 2.38,68.1
  pour Bottom (isolate 0.254): 82.55,0 73.66,0 73.66,5.08 0,5.08 0,53.34 82.55,53.34
  pour Top: 8.89,21.11 8.89,24.45 10.32,25.88 17.3,25.88 17.3,21.11
  pour Top: 18.89,25.88 41.91,25.88 41.91,20.64 34.45,20.64 34.45,22.07 32.23,22.07 32.23,24.13 30.16,24.13 30.16,21.11 23.34,21.11 23.34,22.7 20.8,22.7 20.8,21.27 18.89,21.27
  pour Top (no thermals): 32.23,14.61 39.69,14.61 39.69,13.81 37.94,13.81 37.94,11.75 33.81,11.75 33.81,13.34 32.23,13.34
  pour Top (no thermals): 30.16,12.22 28.42,12.22 26.67,13.97 26.67,14.92 30.16,14.92
  pour Top: 59.69,10.16 64.77,10.16 64.77,6.03 59.69,6.03
N$1
  Top 0.254: U1.11 21.64,44.18 24.13,46.67 30.64,46.67 31.43,45.88 33.66,43.66 R33.1
N$2  (via drill 0.3)
  Top 0.254: U1.27 8.18,38.33 v6.83,40.01
  Bottom 0.254: X5.3 3.17,34.92 3.81,35.56 3.81,37.78 v6.83,40.01
N$3  (via drill 0.3)
  Top 0.254: U1.26 8.64,38.98 v8.1,39.85
  Bottom 0.254: X5.5 3.97,33.66 4.6,34.29 4.6,37.31 v8.1,39.85
N$4  (via drill 0.3)
  Top 0.254: U1.25 9.26,39.63 v9.21,39.69
  Bottom 0.254: X5.7 4.6,32.38 5.4,33.18 5.4,36.83 v9.21,39.69
N$5
  Top 0.254: C17.1 25.54,39.26 Q2.2 24.61,40.16 24.49,40.28 U1.5
N$6
  Top 0.254: C18.1 25.52,43.61 24.45,42.55 24.47,42.55 Q2.1 23.95,42.68 arc90 23.81,42.55 arc-90 22.2,40.93 U1.6
N$7
  Top 0.305: LED1.A R33.2
  Top 0.406: LED1.A 35.52,40.44 JP1.2
N$8  (via drill 0.3)
  Top 0.254: U1.28 8.04,37.68 6.03,39.37 v6.03,40.8
  Bottom 0.254: X5.1 2.54,36.2 3.02,36.67 3.02,38.58 v6.03,40.8
N$9
  Top 0.254: U1.12 21.34,44.83 23.97,47.47 31.11,47.47 33.18,45.4 38.1,40.48 38.89,39.69 R63.2
N$10
  Top 0.254: U1.13 21.03,45.48 23.81,48.26 31.27,48.26 33.97,45.56 40.32,39.21 40.48,39.05 R67.2
N$11
  Top 0.254: U1.16 15.95,45.48 17.46,46.99 R7.2
N$12
  Top 0.254: U1.10 17.97,43.53 15.72,41.27 15.72,35.24 15.08,34.61 11.59,34.61 11.43,34.45 11.43,33.66 11.59,33.5 12.66,33.5 U10.1
N$13
  Top 0.254: U1.14 20.73,46.13 23.65,49.05 31.75,49.05 39.37,41.43 43.66,41.43 44.45,40.64 44.45,37.31 44.61,37.15 44.6,37.15 D1.3 R5.1 46.28,35.04 C39.1
N$14
  Top 0.254: U2.16 30.84,63.62 31.43,63.02 31.75,62.71 32.54,62.71 L10.1
N$15
  Top 0.254: U2.15 30.53,62.97 31.91,61.59 32.27,61.59 L10.2
N$16  (via drill 0.3)
  Top 0.254: v27.62,69.85 28.65,68.82 U2.24 29.59,69.59 C7.2
  Bottom 0.254: v27.62,69.85 27.15,69.85 26.99,69.69 26.99,68.38 C62.1
N$17  (via drill 0.3)
  Top 0.254: U2.17 30.62,64.27 v30.96,64.29
  Bottom 0.254: v30.96,64.29 27.94,64.29 26.67,65.56 C62.2
N$18
  Top 0.254: U2.23 30.55,68.17 30.8,68.42 30.8,70.01 30.96,70.17 31.27,70.17 R25.2
N$19
  Top 0.406: U6.3 38.62,10.79 R12.1 C23.1 39.57,12.06 TR3.3
N$20
  Top 0.254: R3.1 C5.1
N$21
  Top 0.406: R13.2 31,12.18 31.11,12.06 U6.5 | U6.5 31.75,12.06 U6.5
N$22
  Top 0.254: U4.5 29.12,33.36 R23.2 28.78,33.25 R21.1 C13.1
N$23
  Top 0.406: C15.2 34.48,66.36 L1.P$2 34.23,66.22 U2.20
N$24
  Top 0.254: C4.1 29.05,59.17 R2.1 28.85,60.21 28.26,60.8 28.26,64.45 28.57,64.77 28.73,64.92 U2.18
N$25
  Top 0.254: U2.2 22.32,68.17 C3.2
N$26
  Top 0.254: C6.2 27.15,59.17 R2.2 25.52,59.37 C5.2 25.08,59.8 25.08,67.31 24.87,67.52 U2.3
N$27
  Top 0.254: U2.21 31.63,66.87 33.02,68.26 34.13,68.26 34.29,68.42 L1.P$1
  Top 0.61: L1.P$1 34.17,69.61 C9.1 C8.1 34.17,72.8 R4.2
N$28
  Top 0.305: U5.2 48.76,66.29 C27.2
N$29
  Top 0.406: 40.05,66.2 L3.1 | L3.1 40.21,65.32 C16.2 | C15.1 L3.1
N$30
  Top 0.305: U5.7 54.73,66.29 L2.P$2
  Top 0.406: C28.1 55.05,66.36 L2.P$2
N$31
  Top 0.305: X5.10 R16.1
N$32
  Top 0.406: R17.2 31,21.07 31.11,20.95 U3.5
N$33
  Top 0.254: U4.3 34.82,32.71 R22.2 35.24,34.45 35.4,34.61 R20.1 C12.1
N$34
  Top 0.406: F1.1 C28.2
N$35
  Top 0.406: C32.1 F1.3
N$36
  Top 0.406: L3.2 42.39,66.36 | 42.39,66.36 L4.1 | C22.2 42.55,66.2 42.39,66.36
N$37
  Top 0.406: X1.1 C32.2
N$38
  cutout Top: 0,75 7,75 7,82 0,82
  cutout Top: 74.93,75 81.93,75 81.93,82 74.93,82
  cutout Bottom: 0,75 7,75 7,82 0,82
  cutout Bottom: 74.93,75 81.93,75 81.93,82 74.93,82
  cutout Bottom: 0,0.07 7,0.07 7,7.07 0,7.07
  cutout Bottom: 74.93,0.07 81.93,0.07 81.93,7.07 74.93,7.07
N$39
  Top 0.254: U1.15 14.7,46.13 15.56,46.99 R6.2
N$41
  Top 0.254: U2.9 21.55,63.62 19.68,61.75 19.53,61.59 18.57,60.64 | C33.1 18.3,59.14
  Top 0.305: 18.57,60.64 18.57,60.28 C33.1 | 18.3,59.14 Q1.3
N$69
  Top 0.254: C77.1 15.52,64.77
  Top 0.305: 15.52,64.77 TCXO1.3
N$666
  Top 0.61: U3.7 U3.6 29.41,19.68 C20.1 29.01,19.69 C35.1 U8.1
PA_-FAULT  (via drill 0.4)
  Top 0.254: R34.1 22.86,37.62 22.86,37.94 22.23,38.58 20.64,38.58 20.23,38.98 U1.3 18.34,38.98 18.26,38.89 v17.62,38.89 | U6.8 29.84,8.26 v29.21,8.89
  Bottom 0.254: v17.62,38.89 13.81,38.89 10.79,35.88 10.79,29.21 7.62,26.04 7.62,17.94 8.41,17.14 18.57,17.14 20,17.14 20.95,17.14 v29.21,8.89
PA_ON  (via drill 0.3, 0.5)
  Top 0.254: TR3.1 46.67,11.12 v46.99,11.43 | v15.24,44.45 15.24,44.61 14.92,44.77 14.83,44.83 U1.17
  Top 0.305: TR3.1 46.67,11.12 v46.99,11.43
  Top 0.406: TR3.1 44.57,11.12 R1.2
  Bottom 0.254: v15.24,44.45 11.43,44.45 11.43,38.58 9.84,36.83 9.84,36.67 9.84,29.21 6.83,26.19 6.83,17.62 7.94,16.51 17.78,16.51 20.32,16.51 29.21,7.62 40.64,7.62 43.18,10.16 45.72,10.16 v46.99,11.43
RESETBEACON  (via drill 0.5)
  Top 0.254: U1.7 17.13,41.58 16.67,41.12 16.67,36.67 v17.78,35.56 18.1,35.56 19.05,34.61 24.45,34.61 24.77,34.29 24.77,31.91 24.49,31.64 R19.1 23.3,31.43 U7.4 | R16.2 9.96,35.36 10.16,35.56 v13.97,35.56
  Bottom 0.254: v13.97,35.56 v17.78,35.56
RXD  (via drill 0.4)
  Top 0.254: v18.89,49.05 17.58,49.05 R7.1
  Bottom 0.254: X3.3 20.3,12.72 20.32,15.08 20.24,15.16 | 20.24,15.16 19.53,15.88 7.14,15.88 6.03,16.99 6.03,26.35 9.05,29.37 9.05,37.15 10.79,38.89 10.79,44.77 14.29,48.26 14.45,48.42 18.26,48.42 v18.89,49.05 | D5.1 20.24,14.61 20.24,15.16
TXD  (via drill 0.4)
  Top 0.254: v13.97,49.05 15.4,49.05 15.56,49.21 R6.1
  Bottom 0.254: X3.2 17.8,14.9 17.62,15.08 | 17.62,15.08 17.46,15.24 6.51,15.24 5.24,16.51 5.24,26.67 7.62,29.05 8.26,29.69 8.26,37.47 10.16,39.37 10.16,44.13 10.16,44.29 10.16,45.24 v13.97,49.05 | D4.1 17.62,14.61 17.62,15.08
VBEACON_PA
  Top 0.61: U6.7 29.84,9.53 29.21,10.16 C24.1 29.41,10.79 U6.6 28.57,10.79 27.94,10.16 22.86,10.16 21.59,10.16 7.78,10.16 3.17,14.76 3.17,67.63 11.59,76.04 31.75,76.04 33.02,77.31 C30.P$1 55.09,75.71 C26.1 55.13,75.84 C31.1 C29.1 55.13,68.97 L2.P$1
VBUS  (via drill 0.5)
  Top 0.254: R23.1 28.89,30.8 v29.21,30.48 | v55.88,16.51 55.88,14.76
  Top 0.61: 50.8,12.7 X2.10 55.34,14.54 55.56,14.76 55.88,14.76 56.2,14.76 56.59,14.38 X2.9 | 50.8,12.7 46.99,8.89 39.05,8.89 | 39.05,8.89 R12.2 38.85,9.53 U6.2 | U6.1 38.42,8.26 39.05,8.89 | U3.2 38.58,18.41 | 38.58,18.41 45.09,18.41 50.8,12.7 | U3.1 38.42,17.14 38.58,17.3 38.58,18.41
  Bottom 0.254: v29.21,30.48 29.21,29.21 31.75,26.67 50.8,26.67 55.88,21.59 v55.88,16.51
VCCRF  (via drill 0.6)
  Top 0.254: C76.1 10.32,63.93 TCXO1.4
  Top 0.305: U2.1 23.75,69.12 23.65,69.22
  Top 0.406: TCXO1.4 11.23,65.84 12.7,67.31 v13.97,67.31 | v13.97,72.39 13.97,74.93
  Top 0.61: L11.2 11.87,19.89 C38.1 8.85,19.89 5.4,23.34 4.92,23.81 4.92,66.99 12.86,74.93 13.97,74.93 30.64,74.93 | 30.64,74.93 30.48,74.93 27.94,72.39 27.94,71.12 27.82,71 C14.1 C11.1 24.33,71 23.65,70.33 23.65,69.22 | 30.64,74.93 34.29,74.93 | C10.1 34.17,75.05 34.29,74.93 | R4.1 34.29,74.93
  Bottom 0.406: v13.97,67.31 v13.97,72.39

### Text on the board
Top: OSSI-1 | G.O.D.Sat | GODTX_2 | CW Beacon | 144MHz/146MHz
tStop: OSSI-1 | G.O.D.Sat | GODTX_2 | CW Beacon | 144MHz/146MHz